# Altium project scsi40to50.PrjPCB
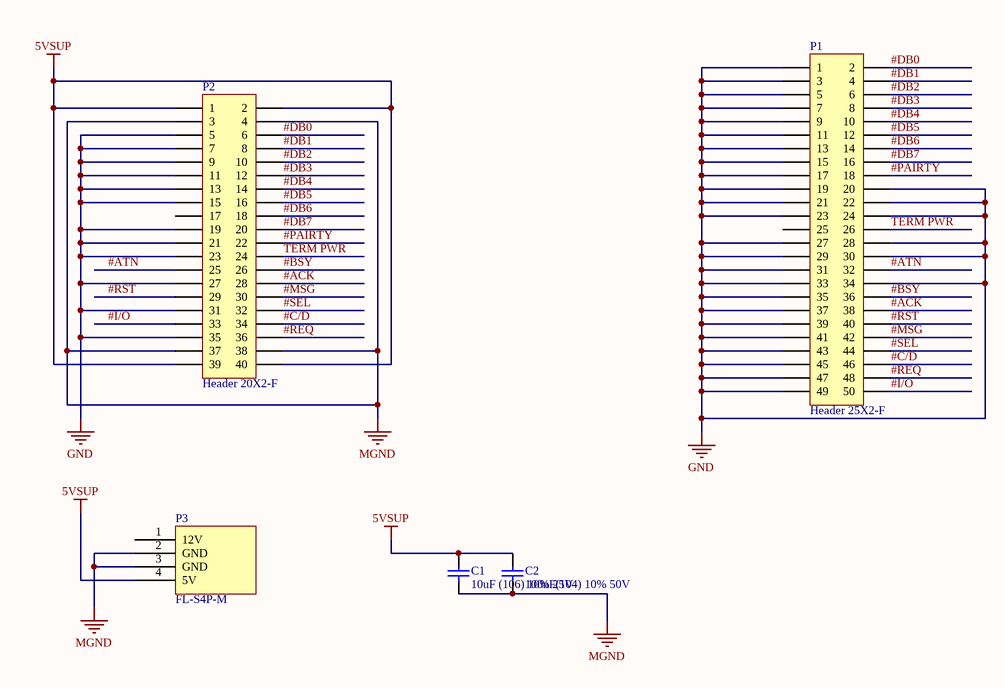
[diagram p0: board.SchDoc]
1 sheet, 5 parts. Net scope: global (net labels, ports and power ports of the same name join across sheets).
Board file: board.PcbDoc

## Sheet board.SchDoc
size A4

### Parts
C1  10uF (106) 10% 25V  [LC-0805_C]
C2  100nF(104) 10% 50V  [LC-0805_C]
P1  Header 25X2-F  [DC2-25*2H/2.54]
P2  Header 20X2-F  [Header 20*2H/2.0]
P3  FL-S4P-M  [FL-S4P-M]

### Nets
5VSUP: C1.2 C2.2 P2.1 P2.2 P2.39 P2.40 P3.4(5V)
GND: P1.1 P1.3 P1.5 P1.7 P1.9 P1.11 P1.13 P1.15 P1.17 P1.19 P1.20 P1.21 P1.22 P1.23 P1.24 P1.27 P1.28 P1.29 P1.30 P1.31 P1.33 P1.34 P1.35 P1.37 P1.39 P1.41 P1.43 P1.45 P1.47 P1.49 P2.5 P2.7 P2.9 P2.11 P2.13 P2.15 P2.19 P2.21 P2.23 P2.27 P2.31 P2.35
MGND: C1.1 C2.1 P2.3 P2.4 P2.37 P2.38 P3.2(GND) P3.3(GND)
#ACK: P1.38 P2.28
#ATN: P1.32 P2.25
#BSY: P1.36 P2.26
#C/D: P1.46 P2.34
#DB0: P1.2 P2.6
#DB1: P1.4 P2.8
#DB2: P1.6 P2.10
#DB3: P1.8 P2.12
#DB4: P1.10 P2.14
#DB5: P1.12 P2.16
#DB6: P1.14 P2.18
#DB7: P1.16 P2.20
#I/O: P1.50 P2.33
#MSG: P1.42 P2.30
#PAIRTY: P1.18 P2.22
#REQ: P1.48 P2.36
#RST: P1.40 P2.29
#SEL: P1.44 P2.32
TERM PWR: P1.26 P2.24

Not connected (* = marked no-connect by the designer): P1 25; P2 17; P3 1(12V)

### Library data of the parts
C1 = 0805 10uF (106) 10% 25V: 贴片电容; ComponentLink1Description: 供应商链接; ComponentLink1URL: http://www.szlcsc.com/product/details_16532.html; Package: 0805; Supplier: LC; SuppliersPartNumber: C15850
C2 = 0805 100nF(104) 10% 50V: 贴片电容; ComponentLink1Description: 供应商链接; ComponentLink1URL: http://www.szlcsc.com/product/details_50686.html; Package: 0805; Supplier: LC; SuppliersPartNumber: C49678
P1 = Header 25X2H: Header, 25-Pin, Dual row, Right Angle; LatestRevisionDate: 17-Jul-2002; LatestRevisionNote: Re-released for DXP Platform.; Publisher: Altium Limited
P2 = Header 20X2H: Header, 20-Pin, Dual row, Right Angle; LatestRevisionDate: 17-Jul-2002; LatestRevisionNote: Re-released for DXP Platform.; Publisher: Altium Limited
P3 = FL-S4P-M: Small 4Pin Power Connector(Male)